# EAGLE design esquema (EAGLE 9.6.2)
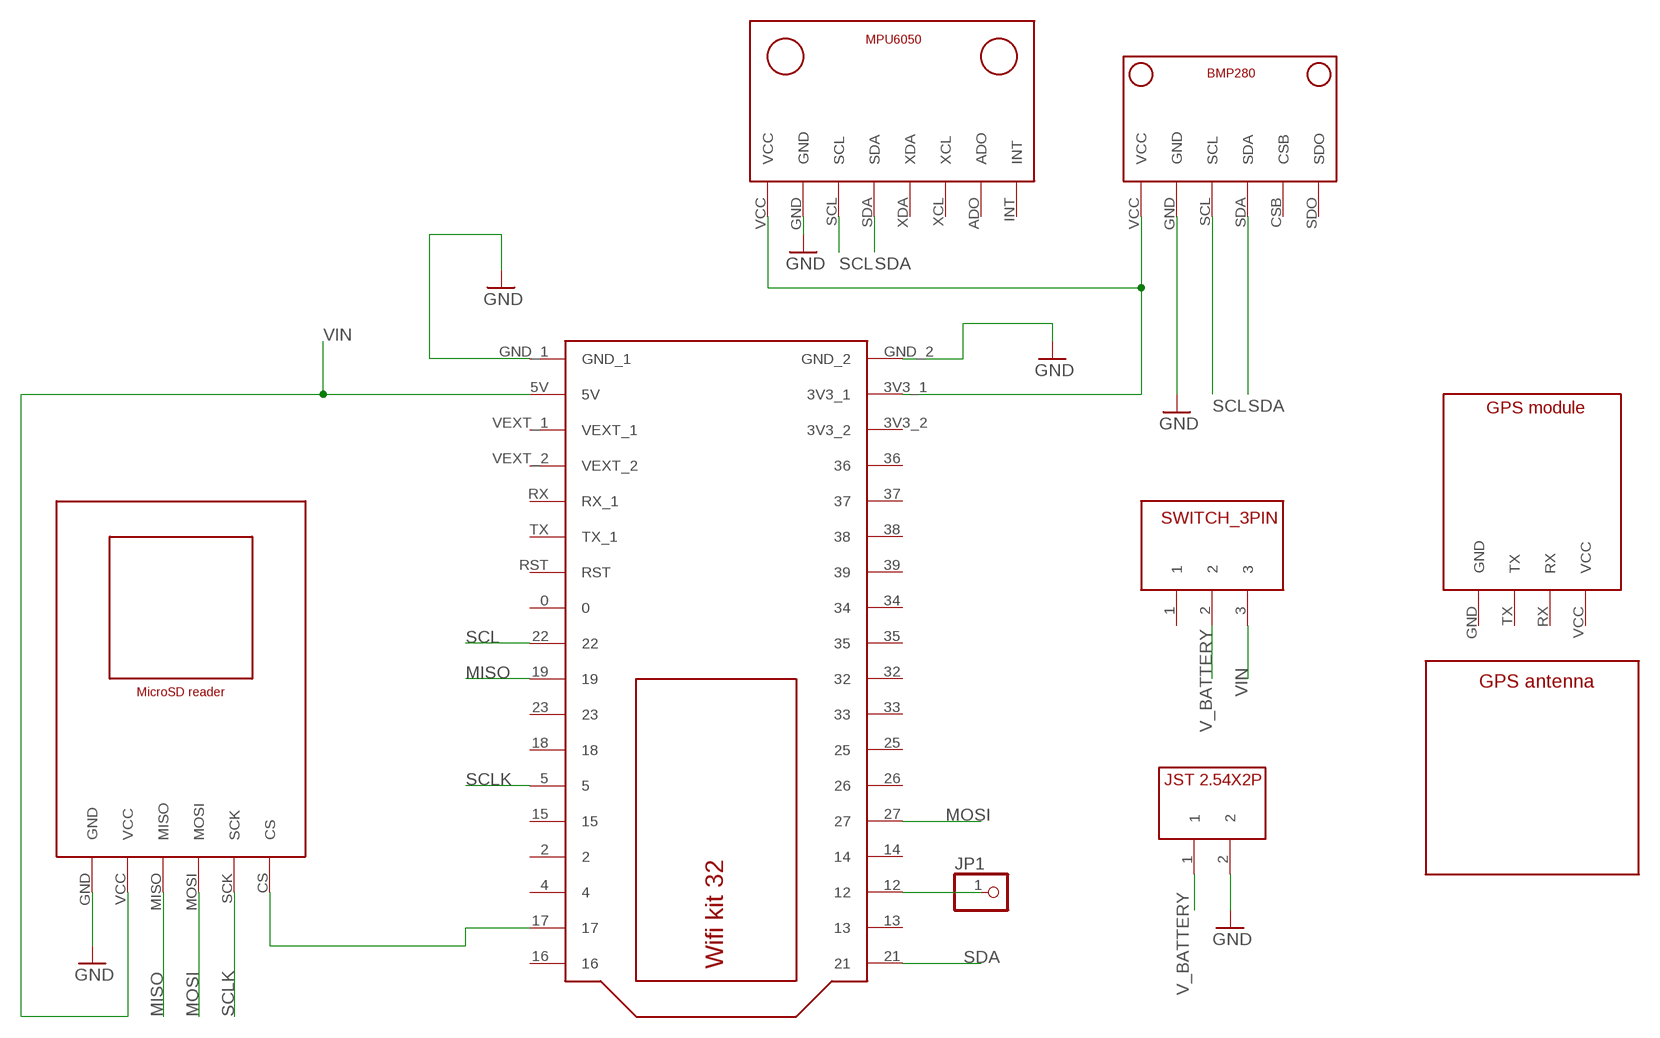
[diagram p0: schematic, sheet 1]

## Parts
JP1  PINHD-1X1  [1X01]
U$1  BMP280V1  [BMP280_FOOTPRINT]
U$2  MICROSD_READER  [MICROSD_READER_FOOTPRINT]
U$3  MPU6050V1  [MPU6050_FOOTPRINT]
U$4  WIFI_KIT32  [WIFI_KIT32]
U$5  JST2.54X2P  [JST2.54X2P_FOOTPRINT]
U$6  SWITCH_3PIN  [SWITCH_3PIN]
U$7  GPS_MODULE  [GPS_MODULE_FOOTPRINT]
U$8  GPS_ANTENNA  [GPS_ANTENNA_FOOTPRINT]

## Nets
GND: U$1.GND U$2.GND U$3.GND U$4.GND_1 U$4.GND_2 U$5.2
MISO: U$2.MISO U$4.19
MOSI: U$2.MOSI U$4.27
N$1: U$2.CS U$4.17
N$2: JP1.1 U$4.12
N$4: U$1.VCC U$3.VCC U$4.3V3_1
SCL: U$1.SCL U$3.SCL U$4.22
SCLK: U$2.SCK U$4.5
SDA: U$1.SDA U$3.SDA U$4.21
V_BATTERY: U$5.1 U$6.2
VIN: U$2.VCC U$4.5V U$6.3
Unconnected: U$1.CSB U$1.SDO U$3.ADO U$3.INT U$3.XCL U$3.XDA U$4.0 U$4.2 U$4.3V3_2 U$4.4 U$4.13 U$4.14 U$4.15 U$4.16 U$4.18 U$4.23 U$4.25 U$4.26 U$4.32 U$4.33 U$4.34 U$4.35 U$4.36 U$4.37 U$4.38 U$4.39 U$4.RST U$4.RX(RX_1) U$4.TX(TX_1) U$4.VEXT_1 U$4.VEXT_2 U$6.1 U$7.GND U$7.RX U$7.TX U$7.VCC

## Library data of the parts
JP1 = pinhead:PINHD-1X1: PIN HEADER
U$1 = CRD:BMP280: Sensor barométrico
U$2 = CRD:MICROSD_READER: Leitor e gravador de cartão SD
U$3 = CRD:MPU6050: Acelerômetro e Giroscópio
U$4 = CRD:WIFI_KIT32: Placa de desenvolvimento ESP32 da Heltech
U$5 = CRD:JST2.54X2P: Conector JST 2 pinos (2.54mm de distância entre pinos)
U$6 = CRD:SWITCH_3PIN
U$7 = CRD:GPS_MODULE
U$8 = CRD:GPS_ANTENNA

## Board
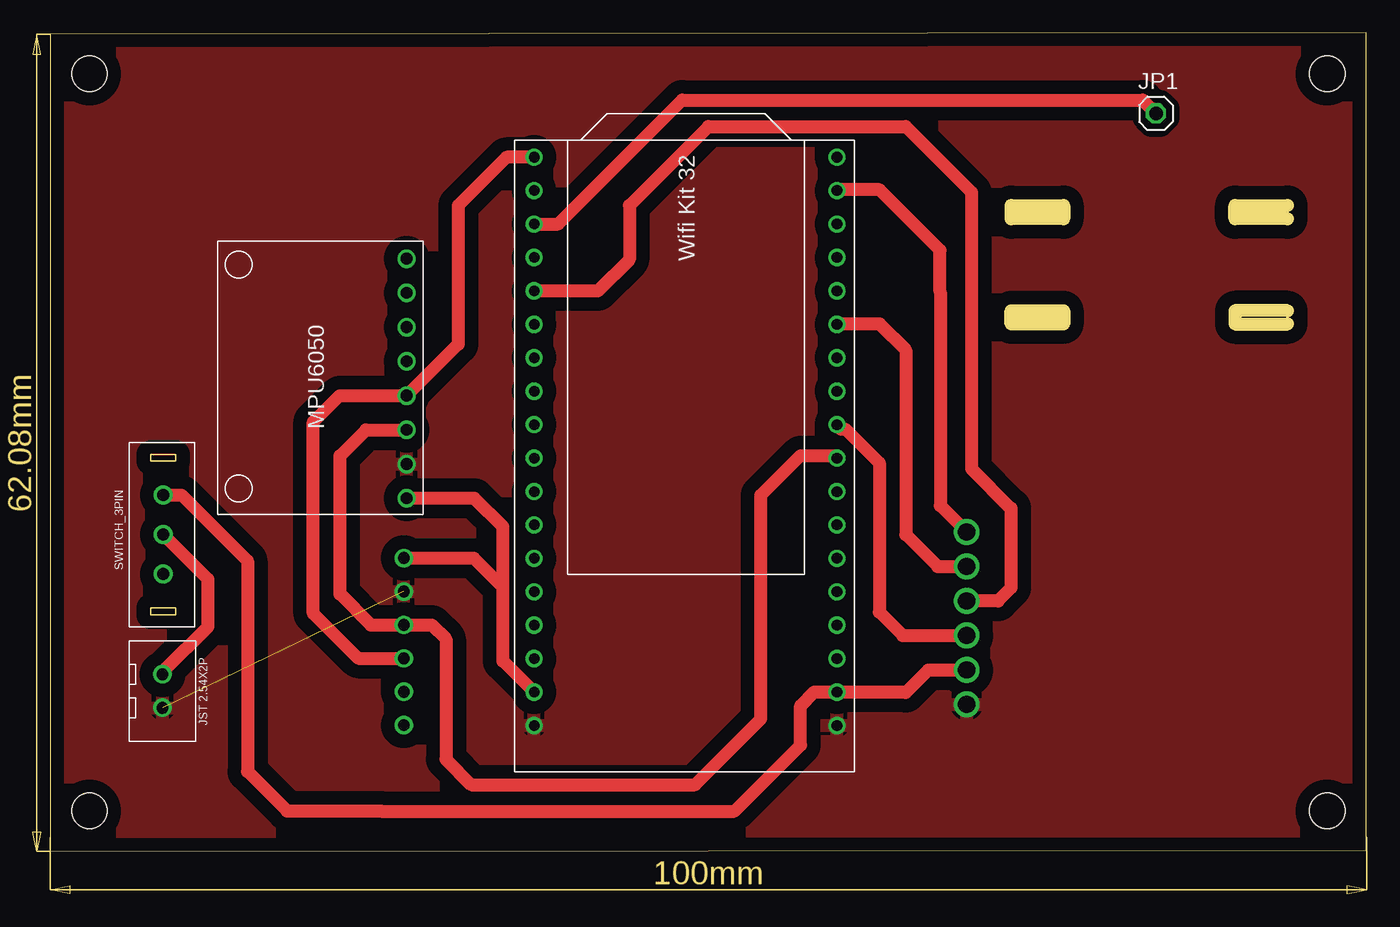
[diagram p1: board, top side]
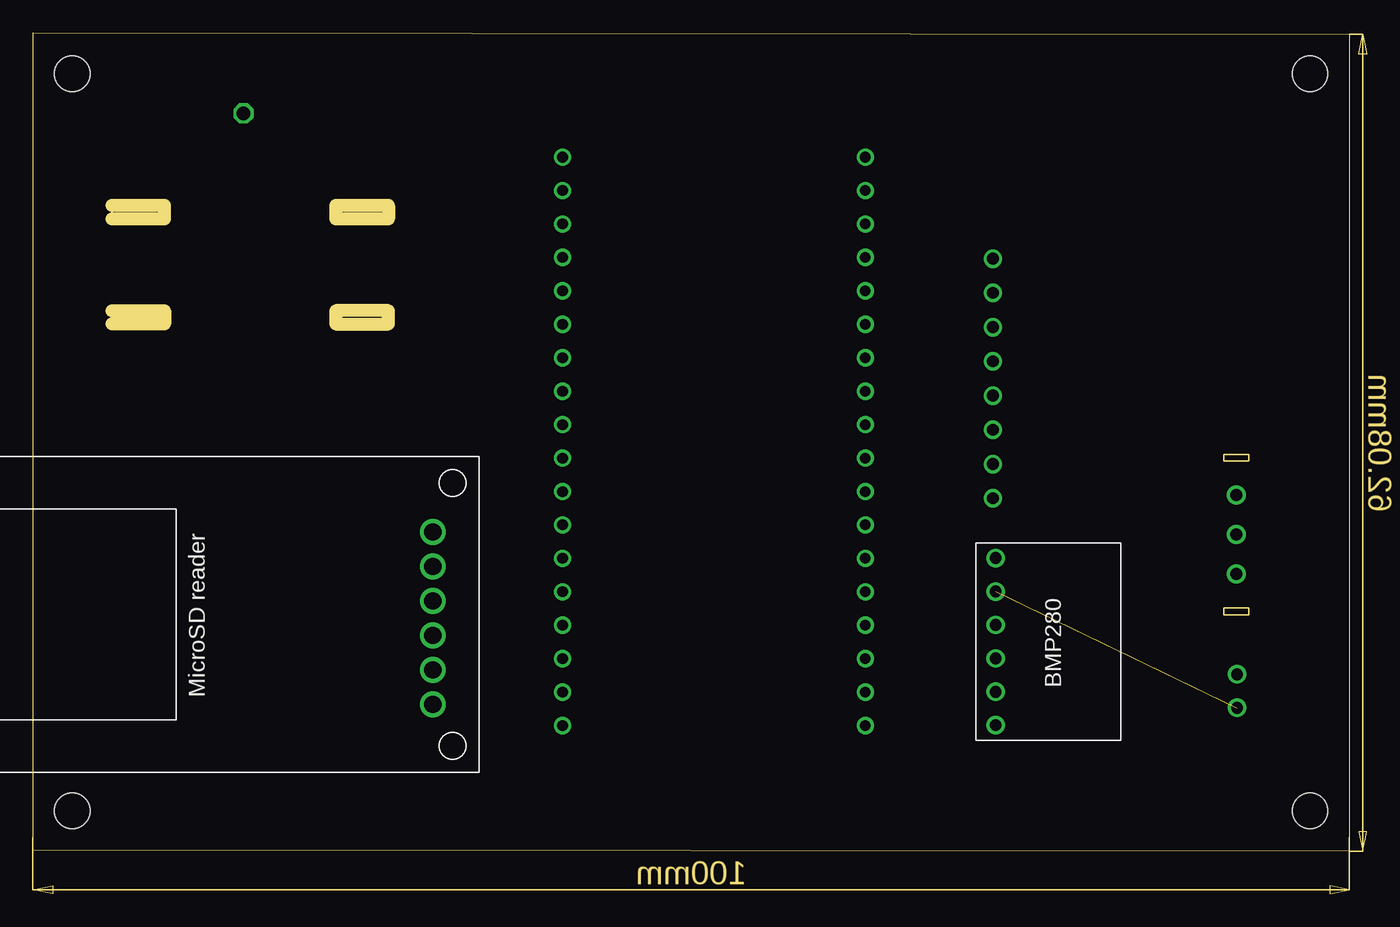
[diagram p2: board, bottom side, seen from below]

Size 99.97 x 62.19 mm. Coordinates in mm from the lower left corner, seen from the top.
Outline: 0,0 99.97,0.1 99.97,62.19 0,62.09 0,0
Outline: 73,49.08 77,49.08 77,48.08 73,48.08 73,49.08
Outline: 77,41.08 77,40.08 73,40.08 73,41.08 77,41.08
Outline: 90,49.08 94,49.08 94,48.08 90,48.08 90,49.08
Outline: 90,41.08 90,40.08 94,40.08 94,41.08 90,41.08
Copper layers (1*16): Top 0.035mm / dielectric 1.5mm / Bottom 0.035mm
Design rules "default *": minimum track width 1mm, minimum drill 0.35mm, track to track 40mil, track to pad 0.5mm, pad to pad 6mil, via to via 6mil, smd to smd 6mil, copper to edge 40mil, drill to drill 6mil, minimum pad ring 10mil, minimum via ring 8mil, stop-mask expansion 4mil, vias tented up to drill 0mil, thermal gap 10mil
Holes 2.7 mm at 97,3.08 97,59.08 3,3.08 3,59.08

### Footprints (pad centres in the part's own frame; a part is rotated, then mirrored left to right if it is on the bottom)
1X01 = drill 1.016 octagon: 1 0,0
BMP280_FOOTPRINT = drill 0.891: CSB 3.686,-6.12; GND -3.934,-6.12; SCL -1.395,-6.12; SDA 1.145,-6.12; SDO 6.226,-6.12; VCC -6.474,-6.12
MICROSD_READER_FOOTPRINT = drill 1.3: CS 6.195,-14.534; GND -6.905,-14.534; MISO -1.665,-14.534; MOSI 0.955,-14.534; SCK 3.575,-14.534; VCC -4.285,-14.534
MPU6050_FOOTPRINT = drill 0.891: ADO 6.686,-10.184; GND -6.314,-10.184; INT 9.286,-10.184; SCL -3.715,-10.184; SDA -1.115,-10.184; VCC -8.915,-10.184; XCL 4.085,-10.184; XDA 1.486,-10.184
WIFI_KIT32 = drill 0.8: 0 -11.77,12.73; 2 -11.77,-5.05; 3V3_1 11.23,27.97; 3V3_2 11.23,25.43; 4 -11.77,-7.59; 5 -11.77,0.03; 5V -11.77,27.97; 12 11.23,-7.59; 13 11.23,-10.13; 14 11.23,-5.05; 15 -11.77,-2.51; 16 -11.77,-12.67; 17 -11.77,-10.13; 18 -11.77,2.57; 19 -11.77,7.65; 21 11.23,-12.67; 22 -11.77,10.19; 23 -11.77,5.11; 25 11.23,2.57; 26 11.23,0.03; 27 11.23,-2.51; 32 11.23,7.65; 33 11.23,5.11; 34 11.23,12.73; 35 11.23,10.19; 36 11.23,22.89; 37 11.23,20.35; 38 11.23,17.81; 39 11.23,15.27; GND_1 -11.77,30.51; GND_2 11.23,30.51; RST -11.77,15.27; RX -11.77,20.35; TX -11.77,17.81; VEXT_1 -11.77,25.43; VEXT_2 -11.77,22.89
JST2.54X2P_FOOTPRINT = drill 0.9: 1 -1.27,0; 2 1.27,0
SWITCH_3PIN = drill 0.93: 1 -3,-1.6; 2 0,-1.6; 3 3,-1.6
GPS_MODULE_FOOTPRINT = drill 0.6: GND -10.16,-21.59; RX 7.239,-21.59; TX -7.62,-21.59; VCC 9.779,-21.59

### Placement (x,y rotation side)
JP1  84,56.08 0 top
U$1  20.75,15.82 270 bottom
U$2  84.16,18.08 90 bottom
U$3  16.9,35.75 90 top
U$4  48,40.08 180 top
U$5  8.54,12.19 270 top
U$6  7,24.08 90 top
U$7  116,57.08 0 top  (outside the outline)
U$8  144,52.08 0 top  (outside the outline)

### Tracks (layer width: path | path; a pad name or v marks a point on that pad's centre or on a via)
GND  (1 unrouted)
  pour Top: 1,61.08 1,1.08 99,1.08 99,61.08
MISO
  Top 1: U$4.19 60.1,32.1 60.41,32.1 62.98,29.53 62.98,18.2 64.77,16.41 U$2.MISO
MOSI
  Top 1: U$4.27 41.6,42.58 44,44.98 44,49.08 50,55.08 65,55.08 70,50.08 70,29.08 73,26.08 73,20.03 72,19.03 U$2.MOSI
N$1
  Top 1: U$4.17 59.84,50.28 63,50.28 67.6,45.68 67.6,42.53 67.63,42.51 67.63,26.27 U$2.CS
N$2
  Top 1: U$4.12 38.59,47.67 48.02,57.1 82.98,57.1 JP1.1
N$4
  Top 1: U$4.3V3_1 34.4,14.48 34.4,20.08 | U$1.VCC 32.19,22.29 34.4,20.08 | U$3.VCC 32.24,26.84 34.4,24.68 34.4,20.08
SCL
  Top 1: U$4.22 59.58,30.08 57,30.08 54,27.08 54,10.08 49,5.08 32,5.08 30.07,7.01 30.07,16.15 29,17.21 U$1.SCL 24.37,17.21 22.02,19.56 22.02,30.05 24,32.04 U$3.SCL
SCLK
  Top 1: U$4.5 59.8,40.08 63,40.08 65,38.08 65,24.08 67.42,21.65 U$2.SCK
SDA
  Top 1: U$4.21 34.67,52.75 31,49.08 31,38.55 U$3.SDA 22,34.64 20,32.64 20,18.08 23.41,14.68 U$1.SDA
V_BATTERY
  Top 1: U$5.1 8.67,13.75 12,17.08 12,20.68 U$6.2
VIN
  Top 1: U$6.3 10,27.08 15,22.08 15,6.08 18,3.08 25.15,3.08 25.16,3.06 51.98,3.06 57,8.08 57,11.08 58.03,12.11 U$4.5V 64.97,12.11 65,12.08 66.72,13.79 U$2.VCC